# EAGLE schematic circuito (EAGLE 7.6.0)
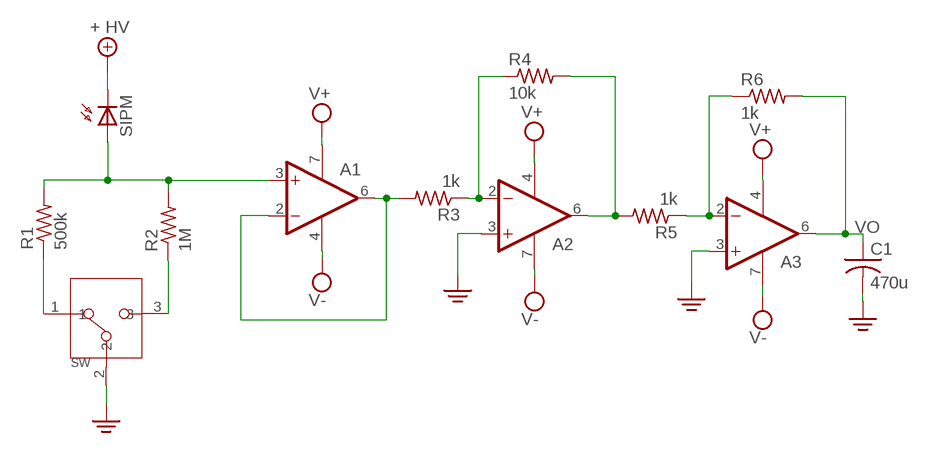
[diagram p0: schematic, sheet 1]

## Parts
A1  1AMP_P7+4D  [SO08]
A2  1AMP_P7+4D  [SO08]
A3  1AMP_P7+4D  [SO08]
C1  470u  C-US025-024X044  [C025-024X044]
R1  500k  R-US_0204/2V  [0204V]
R2  1M  R-US_0204/2V  [0204V]
R3  1k  R-US_0204/2V  [0204V]
R4  10k  R-US_0204/2V  [0204V]
R5  1k  R-US_0204/2V  [0204V]
R6  1k  R-US_0204/2V  [0204V]
SIPM  BP104  [BP104]
SW  DIP-SLIDE-SWITCH(3P-11.6X4.0X5.4+2.0MM)-EG1218  [SW3-2.5-11.6X4.0X5.4+2.0MM]

## Nets
N$3: A1.3(+IN) SIPM.A
N$4: R3.2
N$6: A2.2(-IN)
N$7: R5.2
N$10: A3.2(-IN)
VO: A3.6(OUT)
Unconnected: A1.2(-IN) A1.6(OUT) A2.3(+IN) A2.6(OUT) A3.3(+IN) C1.1 C1.2 R1.1 R1.2 R2.1 R2.2 R3.1 R4.1 R4.2 R5.1 R6.1 R6.2 SIPM.K(C) SW.1 SW.2 SW.3

## Power pins joined to a net without a drawn wire
V+: A1.7(V+) A2.7(V+) A3.7(V+)
V-: A1.4(V-) A2.4(V-) A3.4(V-)

## Library data of the parts
A1-A3 = linear:1AMP_P7+4: OP AMP
C1 = adafruit:C-US: CAPACITOR, American symbol
R1-R6 = adafruit:R-US_: RESISTOR, American symbol
SIPM = opto-trans-siemens:BP104: PHOTO DIODE; MF: VISHAY/TELEFUNKEN; MPN: BP104; OC_FARNELL: 1779636; OC_NEWARK: 14M4504
SW = SWITCH_SPDT:DIP-SLIDE-SWITCH(3P-11.6X4.0X5.4+2.0MM): 311010006; AVAILABILITY: Good; DESCRIPTION: EG Series SPDT On-On Vertical Through Hole Slide Switch; MF: E-Switch; MP: EG1218; PACKAGE: FakePackage u; PRICE: 0.40 USD